# Altium schematic sheet Yusynth VCA.SchDoc
size A4
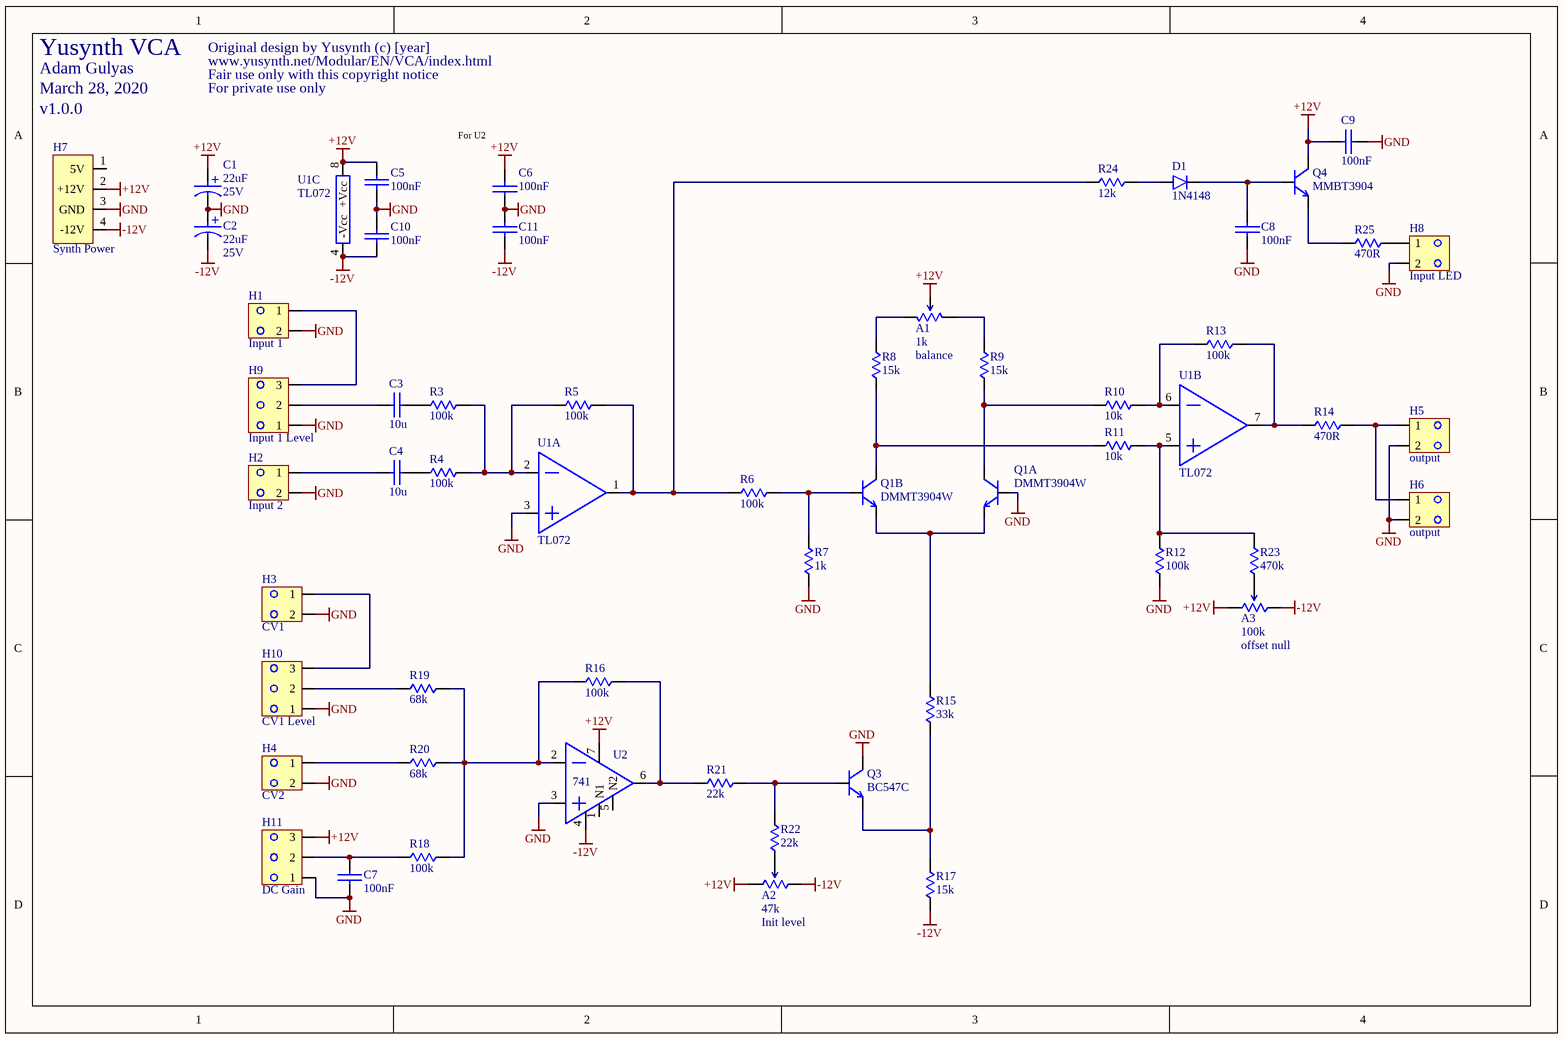
[diagram p0: Yusynth VCA.SchDoc]

## Parts
A1  1k  purpose: balance  [trim pot]
A2  47k  purpose: Init level  [trim pot]
A3  100k  purpose: offset null  [trim pot]
C1  22uF  voltage: 25V  [C - Wurth - SMT - 5mm Dia can]
C2  22uF  voltage: 25V  [C - Wurth - SMT - 5mm Dia can]
C3  10u  [JEDEC - 0805]
C4  10u  [JEDEC - 0805]
C5  100nF  [JEDEC - 0603]
C6  100nF  [JEDEC - 0603]
C7  100nF  [JEDEC - 0603]
C8  100nF  [JEDEC - 0603]
C9  100nF  [JEDEC - 0603]
C10  100nF  [JEDEC - 0603]
C11  100nF  [JEDEC - 0603]
D1  1N4148  [SOD 123]
H1  purpose: Input 1  [H - KK 100 - TH - 1x2]  (hidden comment: 1x2 TH Male)
H2  purpose: Input 2  [H - KK 100 - TH - 1x2]  (hidden comment: 1x2 TH Male)
H3  purpose: CV1  [H - KK 100 - TH - 1x2]  (hidden comment: 1x2 TH Male)
H4  purpose: CV2  [H - KK 100 - TH - 1x2]  (hidden comment: 1x2 TH Male)
H5  purpose: output  [H - KK 100 - TH - 1x2]  (hidden comment: 1x2 TH Male)
H6  purpose: output  [H - KK 100 - TH - 1x2]  (hidden comment: 1x2 TH Male)
H7  Synth Power  [Power Connector 3]
H8  purpose: Input LED  [H - KK 100 - TH - 1x2]  (hidden comment: 1x2 TH Male)
H9  purpose: Input 1 Level  [H - KK 100 - TH - 1x3]  (hidden comment: 1x3 TH Male)
H10  purpose: CV1 Level  [H - KK 100 - TH - 1x3]  (hidden comment: 1x3 TH Male)
H11  purpose: DC Gain  [H - KK 100 - TH - 1x3]  (hidden comment: 1x3 TH Male)
Q1  DMMT3904W  [Diodes Inc - SOT363]  (parts A,B of 2)
Q3  BC547C  [TO 92 - ON Semi]
Q4  MMBT3904  [SOT 23]
R3  100k  [JEDEC - 0603]
R4  100k  [JEDEC - 0603]
R5  100k  [JEDEC - 0603]
R6  100k  [JEDEC - 0603]
R7  1k  [JEDEC - 0603]
R8  15k  [JEDEC - 0603]
R9  15k  [JEDEC - 0603]
R10  10k  [JEDEC - 0603]
R11  10k  [JEDEC - 0603]
R12  100k  [JEDEC - 0603]
R13  100k  [JEDEC - 0603]
R14  470R  [JEDEC - 0603]
R15  33k  [JEDEC - 0603]
R16  100k  [JEDEC - 0603]
R17  15k  [JEDEC - 0603]
R18  100k  [JEDEC - 0603]
R19  68k  [JEDEC - 0603]
R20  68k  [JEDEC - 0603]
R21  22k  [JEDEC - 0603]
R22  22k  [JEDEC - 0603]
R23  470k  [JEDEC - 0603]
R24  12k  [JEDEC - 0603]
R25  470R  [JEDEC - 0603]
U1  TL072  [TI - D (R-PDSO-G8)]  (parts A,B,C of 3)
U2  741  [TI - D (R-PDSO-G8)]

## Nets
+12V: A1.2 A2.3 A3.3 C1.1 C5.2 C6.2 C9.1 H7.2(+12V) H11.3 Q4.3(C) U1.8(+Vcc) U2.7
-12V: A2.1 A3.1 C2.2 C10.1 C11.1 H7.4(-12V) R17.1 U1.4(-Vcc) U2.4
GND: C1.2 C2.1 C5.1 C6.1 C7.1 C8.2 C9.2 C10.2 C11.2 H1.2 H2.2 H3.2 H4.2 H5.2 H6.2 H7.3(GND) H8.2 H9.1 H10.1 H11.1 Q1.1 Q3.1(C) R7.1 R12.1 U1.3 U2.3
NetA1_1: A1.1 R8.2
NetA1_3: A1.3 R9.2
NetA2_2: A2.2 R22.1
NetA3_2: A3.2 R23.1
NetC3_1: C3.1 H9.2
NetC3_2: C3.2 R3.1
NetC4_1: C4.1 H2.1
NetC4_2: C4.2 R4.1
NetC7_2: C7.2 H11.2 R18.1
NetC8_1: C8.1 D1.2 Q4.1(B)
NetD1_1: D1.1 R24.2
NetH1_1: H1.1 H9.3
NetH3_1: H3.1 H10.3
NetH4_1: H4.1 R20.1
NetH5_1: H5.1 H6.1 R14.2
NetH8_1: H8.1 R25.2
NetH10_2: H10.2 R19.1
NetQ1_2: Q1.2 R6.2 R7.2
NetQ1_3: Q1.3 R8.1 R11.1
NetQ1_4: Q1.4 Q1.5 R15.2
NetQ1_6: Q1.6 R9.1 R10.1
NetQ3_2: Q3.2(B) R21.2 R22.2
NetQ3_3: Q3.3(E) R15.1 R17.2
NetQ4_2: Q4.2(E) R25.1
NetR3_2: R3.2 R4.2 R5.1 U1.2
NetR5_2: R5.2 R6.1 R24.1 U1.1
NetR10_2: R10.2 R13.1 U1.6
NetR11_2: R11.2 R12.2 R23.2 U1.5
NetR13_2: R13.2 R14.1 U1.7
NetR16_1: R16.1 R18.2 R19.2 R20.2 U2.2
NetR16_2: R16.2 R21.1 U2.6

Not connected (* = marked no-connect by the designer): H7 1(5V); U2 1(N1) 5(N2)

## Notes on the sheet
- Yusynth VCA
- Original design by Yusynth (c) [year]
- March 28, 2020
- Adam Gulyas
- (near H7) v1.0.0
- Fair use only with this copyright notice
- www.yusynth.net/Modular/EN/VCA/index.html
- For private use only
- (near C6) For U2
- (in symbol c - 22uF 25V Alum SMT) +

## Library data of the parts
A1-A3 = pot - trim - random eBay: trim pot from the random eBay set; MFG: Unknown; Digi-Key PN: N/A; MFG PN: Unknown
C1 C2 = c - 22uF 25V Alum SMT: CAP 22 UF 20% 25 V; MFG: Wurth Electronics Inc.; MFG PN: 865080442004; op temp: -55°C ~ 105°C; Capacitance: 22µF; Type: Aluminum Electrolytic; Digi-Key PN: 732-8432-1-ND; package: Radial, Can - SMD; height: 5.50mm; tolerance: ±20%; series: WCAP-ASLI; price/1 @10: $0.27; ESR: -; Mounting Type: Surface Mount; Size: 5 mm Dia
C3 C4 = c - 10uF 35V 0805: CAP CER 10UF 35V X5R 0805; MFG: Murata; MFG PN: GRM21BR6YA106KE43L; tolerance: ±10%; capacitance: 10µF; op temp: -55°C ~ 85°C; Digi-Key PN: 490-10514-1-ND; package: 0805; voltage: 35V; Temp Coeff: X5R; height: 1.45mm; price/1 @10: $0.419; series: GRM
C5-C11 = c - 100nF: CAP CER 0.1UF 50V X7R 0603; MFG: Yageo; MFG PN: CC0603KRX7R9BB104; tolerance: ±10%; op temp: -55°C ~ 125°C; Digi-Key PN: 311-1344-1-ND; package: 0603; voltage: 50V; capacitance: 100nF; Temp Coeff: X7R; height: 0.90mm; price/1: 0.047
D1 = Diode - 1N4148 - SOD123: DIODE GEN PURP 75V 250MA SOD123; MFG: SMC Diode Solutions; MFG PN: 1N4148WTR; voltage - forward: 1.25V @ 150mA; current - reverse leakage: 2.5µA @ 75V; capacitance: 4pF @ 0V, 1MHz; Reverse Recovery Time: 4ns; op temp: -55°C ~ 150°C; Digi-Key PN: 1655-1360-1-ND; package: SOD-123; current: 250mA; voltage - reverse: 75V; price/1 @10: $0.184
H1-H6 H8 = Header - KK 6373 - 1x2: CONN HEADER 2POS .100 VERT TIN; MFG: Molex; pitch: 100 mil; Digi-Key PN: WM4200-ND; MFG PN: 22-23-2021; price/1 @10: $0.218
H7 = h - Power - 1x4: CONN HEADER EH SIDE 6POS 2.5MM; MFG: S6B-EH(LF)(SN); Shrouding: Shrouded - 3 Wall; op temp: -25°C ~ 85°C; Current Rating: 3A; Digi-Key PN: 455-1629-ND; MFG_PN: S6B-EH(LF)(SN); series: EH; Pitch - Mating: 2.5mm; Fastening Type: Latch Lock; Insulation Height: 4.5mm; price/1 @10: $0.383
H9-H11 = Header - KK 6373 - 1x3: CONN HEADER 3POS .100 VERT TIN; MFG: Molex; MFG PN: 0022232031; pitch: 100 mil; Digi-Key PN: WM4201-ND; price/1 @10: $0.306
Q1 = tran - matched npn - DMMT3904W: TRANS 2NPN 40V 0.2A SOT363; MFG: Diodes Inc.; MFG PN: DMMT3904W-7-F; op temp: -65°C ~ 150°C (TJ); Transistor Type: 2 NPN (Dual) Matched Pair; Current - Collector (Ic) (Max): 200mA; Vce Saturation (Max) @ Ib, Ic: 300mV @ 5mA, 50mA; DC Current Gain (hFE) (Min) @ Ic, Vce: 100 @ 10mA, 1V; Power - Max: 200mW; Frequency - Transition: 300MHz; ComponentLink1Description: datasheet; ComponentLink1URL: C:\Users\Adam Gulyas\Desktop\Electrical Design\datasheets\tran - matched npn\Diodes Inc - DMMT3904W.pdf; Digi-Key PN: DMMT3904W-FDICT-ND; height: 1.1mm; package: 6-TSSOP, SC-88, SOT-363; price/1 @ 10: $0.444; series: -; Voltage - Collector Emitter Breakdown (Max): 40V; Current - Collector Cutoff (Max): -
Q3 = t - BJT - npn - BC547C: TRANS NPN 45V 0.1A TO-92; MFG: ON Semi; Current - Collector: 100mA; Vce Sat: 600mV @ 5mA, 100mA; DC Current Gain (min): 420 @ 2mA, 5V; Power - Max: 500mW; Freq: 300MHz; op temp: 150°C (TJ); MFG PN: BC547CTA; Current - Collector Cutoff (Max): 15nA (ICBO); package: TO-92-3; ComponentLink1Description: datasheet; ComponentLink1URL: https://www.fairchildsemi.com/datasheets/BC/BC546.pdf; Voltage - Collector Emitter Breakdown: 45V; Digi-Key PN: BC547CTACT-ND; price/1 @10: $0.274
Q4 = t - BJT - npn - MMBT3904: TRANS NPN 40V 0.2A SOT23; MFG: ON Semi; Current - Collector: 200mA; Vce Sat: 300mV @ 5mA, 50mA; DC Current Gain (min): 100 @ 10mA, 1V; Power - Max: 300mW; Freq: 300MHz; op temp: *-55°C ~ 150°C; MFG PN: MMBT3904LT1G; package: SOT 23; ComponentLink1Description: datasheet; Voltage - Collector Emitter Breakdown: 40V; Digi-Key PN: MMBT3904LT1GOSCT-ND; price/1 @10: $0.188
R3-R6 R12 R13 R16 R18 = 5 - 100K 5% 0603: RES SMD 100K OHM 5% 1/10W 0603; current: 1.00mA; MFG: Yageo; MFG_PN: RC0603JR-07100KL; power: 0.1W; voltage: 100V; temp. coeff.: ±100ppm/°C; ComponentLink1Description: datasheet; ComponentLink1URL: C:\Users\Adam\Desktop\Reference\datasheets\resistors\Yageo - RC_L series (thick film).pdf; composition: thick film; Digi-Key_PN: 311-56KGRCT-ND; height max: 0.55mm; operating temp: -55°C ~ 155°C; package: 0603; tolerance: ±5%; series: RC; resistance: 100k
R7 = 3 - 1.0K 5% 0603: RES SMD 1K OHM 5% 1/10W 0603; current: 10.0mA; MFG: Yageo; MFG_PN: RC0603JR-071KL; power: 0.1W; voltage: 10V; temp. coeff.: ±100ppm/°C; resistance: 1.0k; ComponentLink1Description: datasheet; ComponentLink1URL: C:\Users\Adam\Desktop\Reference\datasheets\resistors\Yageo - RC_L series (thick film).pdf; composition: thick film; Digi-Key_PN: 311-560GRCT-ND; height max: 0.55mm; operating temp: -55°C ~ 155°C; package: 0603; tolerance: ±5%; series: RC
R8 R9 R17 = 4 - 15K 5% 0603: RES SMD 15K OHM 5% 1/10W 0603; current: 2.58mA; MFG: Yageo; MFG_PN: RC0603JR-0715KL; power: 0.1W; voltage: 38.7V; temp. coeff.: ±100ppm/°C; ComponentLink1Description: datasheet; ComponentLink1URL: C:\Users\Adam\Desktop\Reference\datasheets\resistors\Yageo - RC_L series (thick film).pdf; composition: thick film; Digi-Key_PN: 311-8.2KGRCT-ND; height max: 0.55mm; operating temp: -55°C ~ 155°C; package: 0603; tolerance: ±5%; series: RC; resistance: 15k
R10 R11 = 4 - 10K 5% 0603: RES SMD 10K OHM 5% 1/10W 0603; current: 3.16mA; MFG: Yageo; MFG_PN: RC0603JR-0710KL; power: 0.1W; voltage: 31.6V; temp. coeff.: ±100ppm/°C; ComponentLink1Description: datasheet; ComponentLink1URL: C:\Users\Adam\Desktop\Reference\datasheets\resistors\Yageo - RC_L series (thick film).pdf; composition: thick film; Digi-Key_PN: 311-5.6KGRCT-ND; height max: 0.55mm; operating temp: -55°C ~ 155°C; package: 0603; tolerance: ±5%; series: RC; resistance: 10k
R14 R25 = 2 - 470R 5% 0603: RES SMD 470 OHM 5% 1/10W 0603; current: 14.6mA; MFG: Yageo; MFG_PN: RC0603JR-07470RL; power: 0.1W; voltage: 6.86V; temp. coeff.: ±100ppm/°C; ComponentLink1Description: datasheet; ComponentLink1URL: C:\Users\Adam\Desktop\Reference\datasheets\resistors\Yageo - RC_L series (thick film).pdf; composition: thick film; Digi-Key_PN: 311-270GRCT-ND; height max: 0.55mm; operating temp: -55°C ~ 155°C; package: 0603; tolerance: ±5%; series: RC; resistance: 470R
R15 = 4 - 33K 5% 0603: RES SMD 33K OHM 5% 1/10W 0603; current: 1.74mA; MFG: Yageo; MFG_PN: RC0603JR-0733KL; power: 0.1W; voltage: 57.4V; temp. coeff.: ±100ppm/°C; ComponentLink1Description: datasheet; ComponentLink1URL: C:\Users\Adam\Desktop\Reference\datasheets\resistors\Yageo - RC_L series (thick film).pdf; composition: thick film; Digi-Key_PN: 311-18KGRCT-ND; height max: 0.55mm; operating temp: -55°C ~ 155°C; package: 0603; tolerance: ±5%; series: RC; resistance: 33k
R19 R20 = 4 - 68K 5% 0603: RES SMD 68K OHM 5% 1/10W 0603; current: 1.21mA; MFG: Yageo; MFG_PN: RC0603JR-0768KL; power: 0.1W; voltage: 82.5V; temp. coeff.: ±100ppm/°C; ComponentLink1Description: datasheet; ComponentLink1URL: C:\Users\Adam\Desktop\Reference\datasheets\resistors\Yageo - RC_L series (thick film).pdf; composition: thick film; Digi-Key_PN: 311-39KGRCT-ND; height max: 0.55mm; operating temp: -55°C ~ 155°C; package: 0603; tolerance: ±5%; series: RC; resistance: 68k
R21 R22 = 4 - 22K 5% 0603: RES SMD 22K OHM 5% 1/10W 0603; current: 2.13mA; MFG: Yageo; MFG_PN: RC0603JR-0722KL; power: 0.1W; voltage: 46.9V; temp. coeff.: ±100ppm/°C; ComponentLink1Description: datasheet; ComponentLink1URL: C:\Users\Adam\Desktop\Reference\datasheets\resistors\Yageo - RC_L series (thick film).pdf; composition: thick film; Digi-Key_PN: 311-12KGRCT-ND; height max: 0.55mm; operating temp: -55°C ~ 155°C; package: 0603; tolerance: ±5%; series: RC; resistance: 22k
R23 = 5 - 470K 5% 0603: RES SMD 470K OHM 5% 1/10W 0603; current: 0.461mA; MFG: Yageo; MFG_PN: RC0603JR-07470KL; power: 0.1W; voltage: 217V; temp. coeff.: ±100ppm/°C; ComponentLink1Description: datasheet; ComponentLink1URL: C:\Users\Adam\Desktop\Reference\datasheets\resistors\Yageo - RC_L series (thick film).pdf; composition: thick film; Digi-Key_PN: 311-270KGRCT-ND; height max: 0.55mm; operating temp: -55°C ~ 155°C; package: 0603; tolerance: ±5%; series: RC; resistance: 470k
R24 = 4 - 12K 5% 0603: RES SMD 12K OHM 5% 1/10W 0603; current: 2.89mA; MFG: Yageo; MFG_PN: RC0603JR-0712KL; power: 0.1W; voltage: 34.6V; temp. coeff.: ±100ppm/°C; ComponentLink1Description: datasheet; ComponentLink1URL: C:\Users\Adam\Desktop\Reference\datasheets\resistors\Yageo - RC_L series (thick film).pdf; composition: thick film; Digi-Key_PN: 311-6.8KGRCT-ND; height max: 0.55mm; operating temp: -55°C ~ 155°C; package: 0603; tolerance: ±5%; series: RC; resistance: 12k
U1 = op amp - TL072: IC OPAMP JFET 3MHZ 8SOIC; MFG: TI; MFG PN: TL072CDR; op temp: 0°C ~ 70°C; Amplifier Type: J-FET; Number of Circuits: 2; Slew Rate: 13 V/µs; Current - Input Bias: 65pA; Voltage - Input Offset: 3mV; Current - Supply: 1.4mA; Voltage - Supply, Single/Dual (±): ±5 V ~ 15 V; Digi-Key PN: 296-1282-1-ND; package: 8-SOIC (0.154", 3.90mm Width); price/1 @ 10: $0.804; Output Type: -; Gain Bandwidth Product: 3MHz; ComponentLink1Description: datasheet
U2 = op amp - UA741 - TI UA741CDR: IC OPAMP GP 1MHZ 8SOIC; MFG: TI; Voltage - Supply: 7 V ~ 36 V, ±3.5 V ~ 18 V; Slew Rate: 0.5 V/µs; Current - Input Bias: 80nA; Voltage - Input Offset: 1mV; Current - Supply: 1.7mA; op temp: 0°C ~ 70°C; Amplifier Type: General Purpose; Current - Output / Channel: 25mA; Digi-Key PN: 296-15051-1-ND; MFG PN: UA741CDR; package: 8-SOIC (0.154", 3.90mm Width); GBP: 1MHz; price/1: $0.70